# EAGLE design blinky_board (EAGLE 9.6.0)
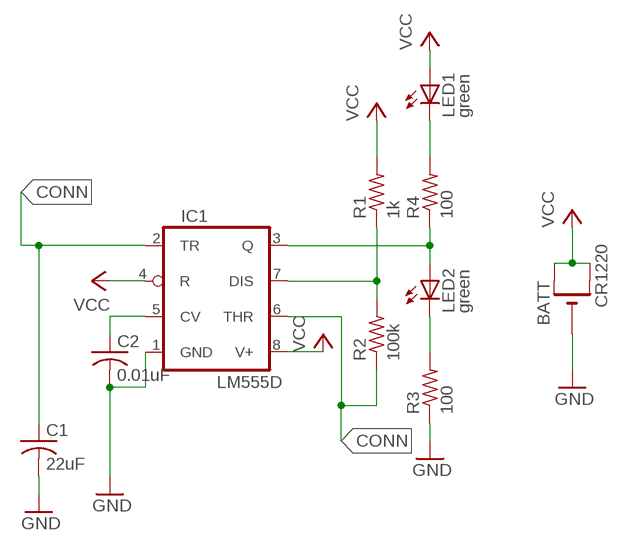
[diagram p0: schematic, sheet 1]

## Parts
BATT  CR1220  CR1220SMT  [CR1220-SMD]
C1  22uF  C-USC0805  [C0805]
C2  0.01uF  C-USC0805  [C0805]
IC1  LM555D  [SO08]
LED1  green  LEDCHIPLED_0805  [CHIPLED_0805]
LED2  green  LEDCHIPLED_0805  [CHIPLED_0805]
R1  1k  R-US_R0805  [R0805]
R2  100k  R-US_R0805  [R0805]
R3  100  R-US_R0805  [R0805]
R4  100  R-US_R0805  [R0805]

## Nets
CONN: C1.1 IC1.2(TR) IC1.6(THR) R2.1
GND: BATT.- C1.2 C2.2 IC1.1(GND) R3.1
N$1: LED1.C R4.2
N$2: IC1.3(Q) LED2.A R4.1
N$3: LED2.C R3.2
N$4: IC1.7(DIS) R1.1 R2.2
N$7: C2.1 IC1.5(CV)
VCC: BATT.+$1(+) BATT.+$2(+1) IC1.4(R) IC1.8(V+) LED1.A R1.2

## Library data of the parts
BATT = adafruit:CR1220: CR1216/CR1220/CR1225 12mm 3V lithium coin cell Great for battery packup. Both SMT and THM holders. Note the THM package has the ground pads on both sides of the PCB so that the masks are the same - this reduces the cost; OC_NEWARK: unknown
C1 = adafruit:C-US: CAPACITOR, American symbol; MF: SAMSUNG ELECTRO-MECHANICS; MPN: CL21A226MPCLRNC; OC_NEWARK: 02AH6823
C2 = adafruit:C-US: CAPACITOR, American symbol; MF: KEMET; MPN: C0805J103K3RACAUTO; OC_NEWARK: 02AC3534
IC1 = adafruit:*555: TIMER Changed DIP package to have round (not oval) pin pads http://www.ladyada.net/library/pcb/eaglelibrary.html; MF: TEXAS INSTRUMENTS; MPN: TLC555CDR; OC_NEWARK: 33AH5036
LED1 LED2 = adafruit:LED: LED OSRAM: - CHIPLED LG R971, LG N971, LY N971, LG Q971, LY Q971, LO R971, LY R971 LH N974, LH R974 LS Q976, LO Q976, LY Q976 LO Q996 - Hyper CHIPLED LW Q18S LB Q993, LB Q99A, LB R99A - SideLED LS A670, LO A670, LY A670, LG A670, LP A670 LB A673, LV A673, LT A673, LW A673 LH A674 LY A675 LS A676, LA A676, LO A676, LY A676, LW A676 LS A679, LY A679, LG A679 - Hyper Micro SIDELED® LS Y876, LA Y876, LO Y876, LY Y876 LT Y87S - SmartLED LW L88C, LW L88S LB L89C, LB L89S, LG L890 LS L89K, LO L89K, LY L89K LS L896, LA L896, LO L896, LY L896 - TOPLED LS T670, LO T670, LY T670, LG T670, LP T670 LSG T670, LSP T670, LSY T670, LOP T670, LYG T670 LG T671, LOG T671, LSG T671 LB T673, LV T673, LT T673, LW T673 LH T674 LS T676, LA T676, LO T676, LY T676, LB T676, LH T676, LSB T676, LW T676 LB T67C, LV T67C, LT T67C, LS T67K, LO T67K, LY T67K, LW E67C LS E67B, LA E67B, LO E67B, LY E67B, LB E67C, LV E67C, LT E67C LW T67C LS T679, LY T679, LG T679 LS T770, LO T770, LY T770, LG T770, LP T770 LB T773, LV T773, LT T773, LW T773 LH T774 LS E675, LA E675, LY E675, LS T675 LS T776, LA T776, LO T776, LY T776, LB T776 LHGB T686 LT T68C, LB T68C - Hyper Mini TOPLED® LB M676 - Mini TOPLED Santana® LG M470 LS M47K, LO M47K, LY M47K Source: http://www.osram.convergy.de/; MF: LUMEX; MPN: SML-LX0805GC-TR; OC_NEWARK: 09J9136
R1 = adafruit:R-US_: RESISTOR, American symbol; MF: PANASONIC; MPN: EXBN8V102JX; OC_NEWARK: 12AC1250
R2 = adafruit:R-US_: RESISTOR, American symbol; MF: MULTICOMP PRO; MPN: MCHP05W4F1003T5E; OC_NEWARK: 01N6990
R3 R4 = adafruit:R-US_: RESISTOR, American symbol; MF: VISHAY; MPN: CRCW0805100RJNEA; OC_NEWARK: 01H7765

## Board
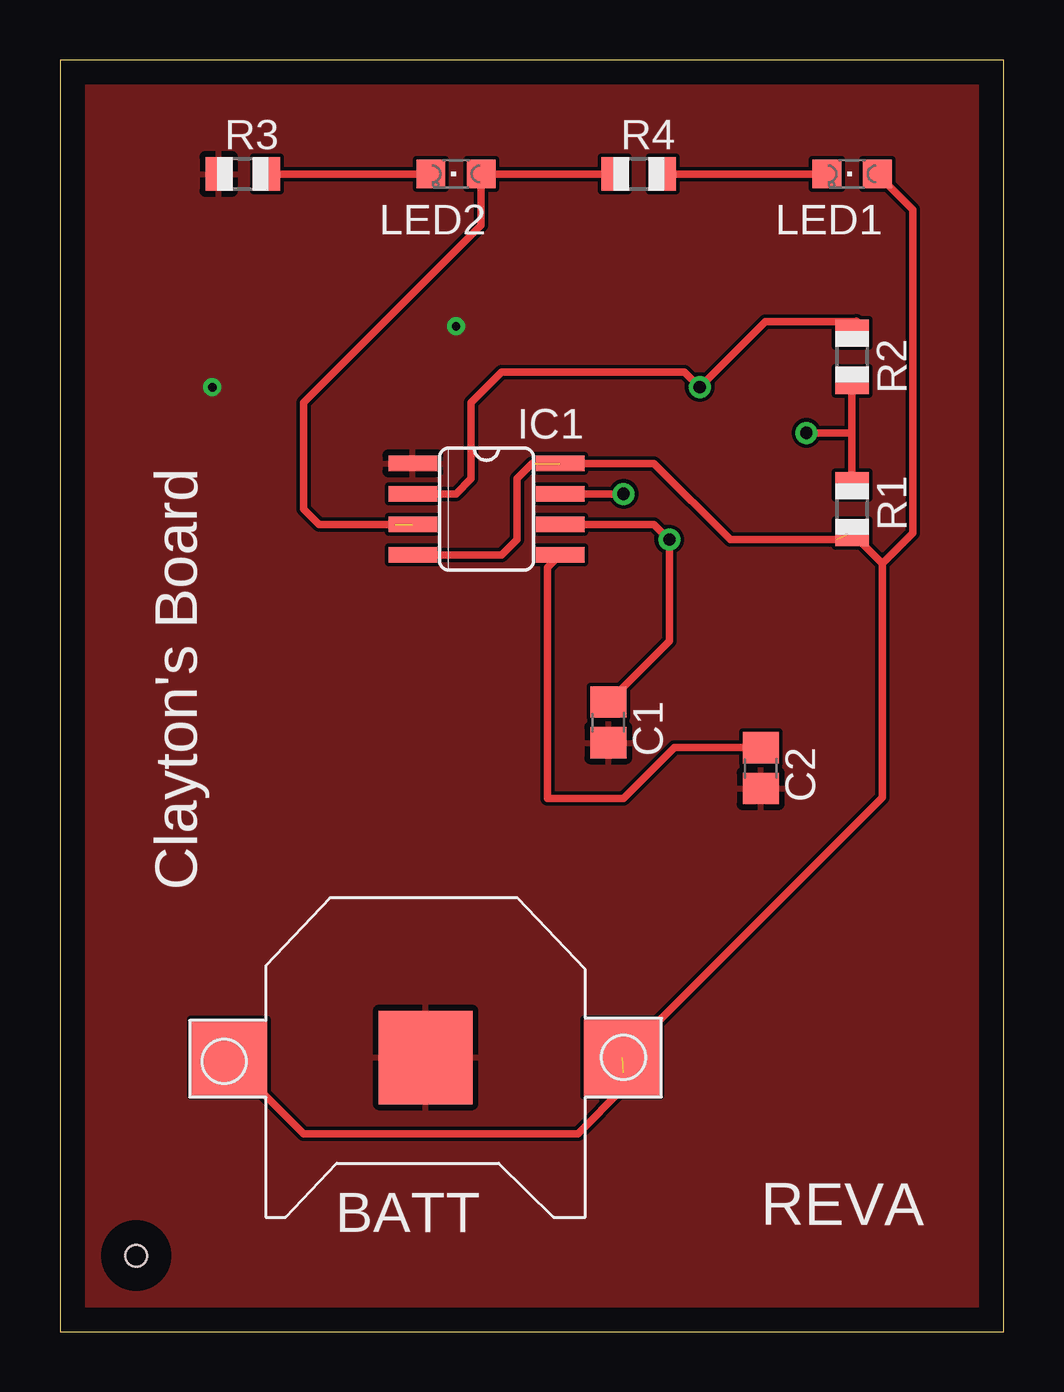
[diagram p1: board, top side]
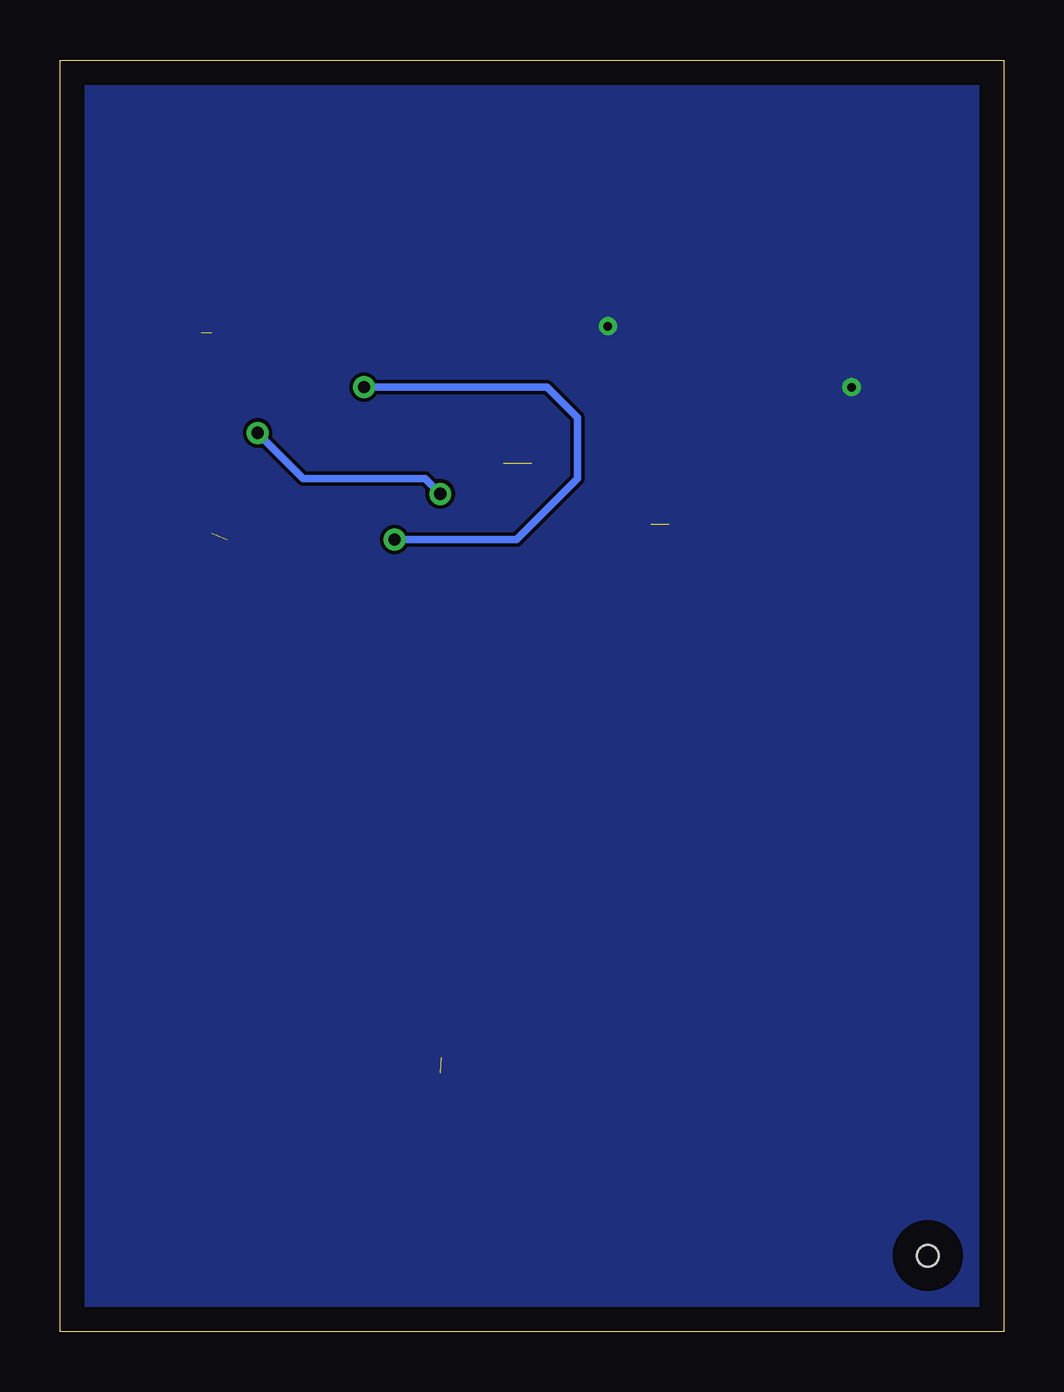
[diagram p2: board, bottom side, seen from below]

Size 39.35 x 53.01 mm. Coordinates in mm from the lower left corner, seen from the top.
Outline: 0,0 39.35,0 39.35,53.01 0,53.01 0,0
Copper layers (1*16): Top 0.035mm / dielectric 1.5mm / Bottom 0.035mm
Design rules "default": minimum track width 6mil, minimum drill 0.35mm, track to track 6mil, track to pad 6mil, pad to pad 6mil, via to via 6mil, smd to smd 6mil, copper to edge 40mil, drill to drill 6mil, minimum pad ring 10mil, minimum via ring 8mil, stop-mask expansion 4mil, vias tented up to drill 0mil, thermal gap 10mil
Holes 0.9 mm at 3.17,3.17

### Footprints (pad centres in the part's own frame; a part is rotated, then mirrored left to right if it is on the bottom)
CR1220-SMD = smd 3.2 x 3.2: +$1 -8.2,0; +$2 8.2,0 | smd 3.9 x 3.9: - 0,0
C0805 = smd 1.3 x 1.5: 1 -0.85,0; 2 0.85,0
SO08 = smd 0.66 x 2.032: 1 -1.905,-3.073; 2 -0.635,-3.073; 3 0.635,-3.073; 4 1.905,-3.073; 5 1.905,3.073; 6 0.635,3.073; 7 -0.635,3.073; 8 -1.905,3.073
CHIPLED_0805 = smd 1.2 x 1.2: A 0,-1.05; C 0,1.05
R0805 = smd 1.1 x 1.4: 1 -1,0; 2 1,0

### Placement (x,y rotation side)
BATT  15.24,11.43 180 top
C1  22.86,25.4 270 top
C2  29.21,23.5 270 top
IC1  17.78,34.29 270 top
LED1  33.02,48.26 90 top
LED2  16.51,48.26 90 top
R1  33.02,34.29 270 top
R2  33.02,40.64 270 top
R3  7.62,48.26 0 top
R4  24.13,48.26 0 top

### Tracks (layer width: path | path; a pad name or v marks a point on that pad's centre or on a via)
CONN  (via drill 0.51)  (1 unrouted)
  Top 0.305: C1.1 25.4,28.79 v25.4,33.02 24.77,33.66 IC1.6 | 33.46,41.64 33.46,41.85 33.19,42.12 32.81,42.11 29.41,42.11 v26.67,39.37 26.04,40.01 18.41,40.01 17.14,38.73 17.14,35.56 16.51,34.92 IC1.2
  Bottom 0.305: v25.4,33.02 20.32,33.02 17.78,35.56 17.78,38.1 19.05,39.37 v26.67,39.37
GND  (via drill 0.35)
  other vias: 6.35,39.37 16.51,41.91
  pour Top: -1.27,53.34 -1.27,-1.27 40.64,-1.27 40.64,53.34
  pour Bottom: -1.27,53.34 -1.27,-1.27 40.64,-1.27 40.64,54.61 0,54.61
N$1
  Top 0.305: R4.2 LED1.C
N$2  (1 unrouted)
  Top 0.305: R4.1 LED2.A 17.56,46.13 10.16,38.73 10.16,34.29 10.79,33.66 13.97,33.66
N$3
  Top 0.305: R3.2 LED2.C
N$4  (via drill 0.51)
  Top 0.305: R2.2 33.02,37.47 | 33.02,37.47 R1.1 | IC1.7 v23.5,34.92 | v31.11,37.47 33.02,37.47
  Bottom 0.305: v23.5,34.92 24.13,35.56 29.21,35.56 v31.11,37.47
N$7
  Top 0.305: 29.21,24.77 C2.1 25.61,24.34 23.5,22.23 20.32,22.23 20.32,31.85 IC1.5
VCC  (3 unrouted)
  Top 0.305: BATT.+$2 7.04,11.38 10.16,8.26 21.59,8.26 23.5,10.16 23.5,10.79 | BATT.+$1 34.29,22.28 34.29,32.02 | R1.2 34.29,32.02 | 34.29,32.02 35.56,33.29 35.56,46.77 LED1.A | 32.38,33.02 27.94,33.02 24.77,36.2 IC1.8 | IC1.4 18.41,32.38 19.05,33.02 19.05,35.56 19.68,36.2

### Text on the board
tPlace: Clayton's Board | REVA